# Altium project AMC_FMC_Carrier v4.PrjPcb (part 13 of 18)

## Sheet Clock_management.SchDoc: AMC FMC Carrier v4
size 420 x 297 mm; CompanyName: WUT; Organization: WUT ISE; Address1: Warsaw Univeristy of Technology; Address2: Nowowiejska 15/19 00-665 Warsaw; Address3: t.przywozki@gmail.com; Revision: 1; SheetNumber: 22; SheetTotal: 29; Project: AMC FMC Carrier v4; ModifiedBy: -; CheckedDate: -; Title2: Clock Management; DivGrp: ISE; Designer: T. Przywozki; ModifiedDate: -; ProjectName: ADC/DAC MEZZANINE
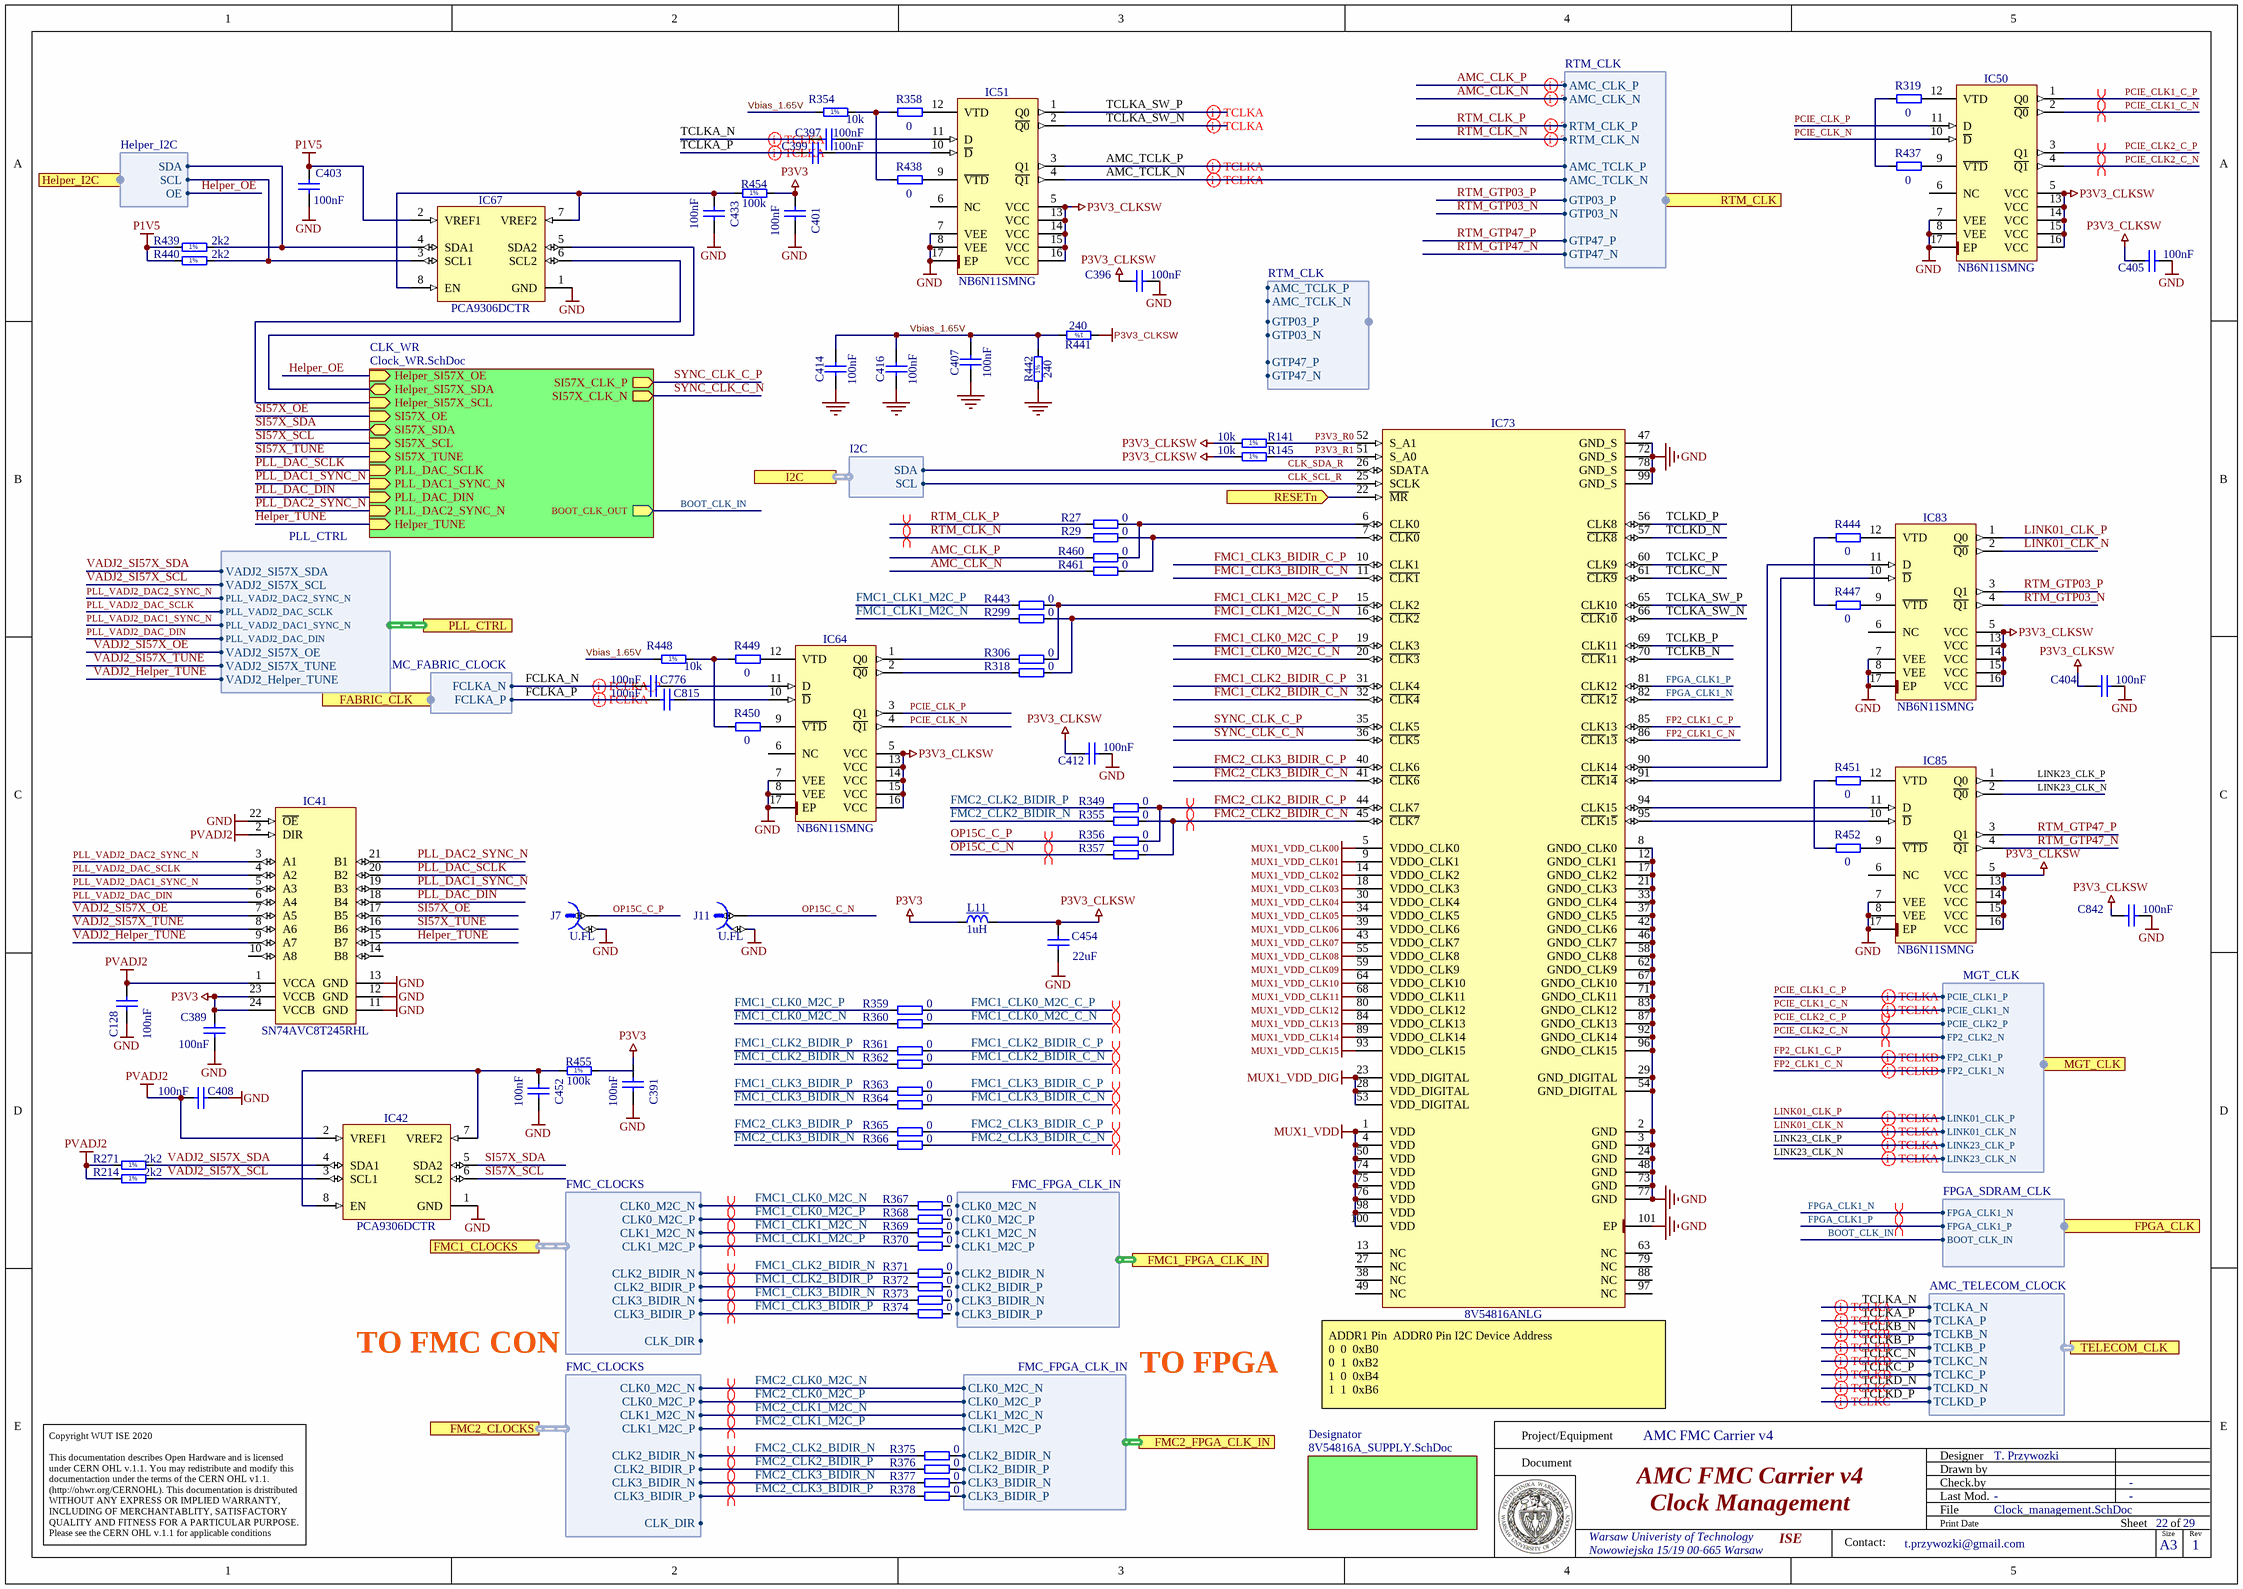
[diagram p23: Clock_management.SchDoc]

### Parts
(Parts that share a designator on the sheet are numbered #1, #2 ... from top to bottom, then left to right.)
C128  100nF  [CAPC0603X33N]
C389  100nF  [CAPC0603X33N]
C391  100nF  [CAPC0603X33N]
C396  100nF  [CAPC0603X33N]
C397  100nF  [CAPC0603X33N]
C399  100nF  [CAPC0603X33N]
C401  100nF  [CAPC0603X33N]
C403  100nF  [CAPC0603X33N]
C404  100nF  [CAPC0603X33N]
C405  100nF  [CAPC0603X33N]
C407  100nF  [CAPC0603X33N]
C408  100nF  [CAPC0603X33N]
C412  100nF  [CAPC0603X33N]
C414  100nF  [CAPC0603X33N]
C416#1  100nF  [CAPC0603X33N]
C433#1  100nF  [CAPC0603X33N]
C452#1  100nF  [CAPC0603X33N]
C454  22uF  [CAPC3216X180N]
C776  100nF  [CAPC0603X33N]
C815  100nF  [CAPC0603X33N]
C842  100nF  [CAPC0603X33N]
IC41  SN74AVC8T245RHL  [TEXAS_RHL (S-PVQFN-N24)]
IC42  PCA9306DCTR  [SOP65P400X130-8N]
IC50#1  NB6N11SMNG  [QFN50P300X300X100-17N-S185]
IC51#1  NB6N11SMNG  [QFN50P300X300X100-17N-S185]
IC64  NB6N11SMNG  [QFN50P300X300X100-17N-S185]
IC67  PCA9306DCTR  [SOP65P400X130-8N]
IC73  8V54816ANLG  [QFN40P1200X1200X90-101N-S690]
IC83  NB6N11SMNG  [QFN50P300X300X100-17N-S185]
IC85  NB6N11SMNG  [QFN50P300X300X100-17N-S185]
J7  U.FL  [HIROSE_U.FL-R-SMT-1(10)]
J11  U.FL  [HIROSE_U.FL-R-SMT-1(10)]
L11  1uH  [IND_PANASONIC_ELLVGG]
R27  0  [RESC1005X40N]
R29  0  [RESC1005X40N]
R141  10k  [RESC1005X40N]
R145  10k  [RESC1005X40N]
R214  2k2  [RESC1005X40N]
R271  2k2  [RESC1005X40N]
R299  0  [RESC1005X40N]
R306  0  [RESC1005X40N]
R318  0  [RESC1005X40N]
R319  0  [RESC1005X40N]
R349  0  [RESC1005X40N]
R354  10k  [RESC1005X40N]
R355  0  [RESC1005X40N]
R356  0  [RESC1005X40N]
R357  0  [RESC1005X40N]
R358  0  [RESC1005X40N]
R359  0  [RESC1005X40N]
R360  0  [RESC1005X40N]
R361  0  [RESC1005X40N]
R362  0  [RESC1005X40N]
R363  0  [RESC1005X40N]
R364  0  [RESC1005X40N]
R365  0  [RESC1005X40N]
R366  0  [RESC1005X40N]
R367  0  [RESC1005X40N]
R368  0  [RESC1005X40N]
R369  0  [RESC1005X40N]
R370  0  [RESC1005X40N]
R371  0  [RESC1005X40N]
R372  0  [RESC1005X40N]
R373  0  [RESC1005X40N]
R374  0  [RESC1005X40N]
R375  0  [RESC1005X40N]
R376  0  [RESC1005X40N]
R377  0  [RESC1005X40N]
R378  0  [RESC1005X40N]
R437  0  [RESC1005X40N]
R438  0  [RESC1005X40N]
R439  2k2  [RESC1005X40N]
R440  2k2  [RESC1005X40N]
R441  240  [RESC1005X40N]
R442  240  [RESC1005X40N]
R443  0  [RESC1005X40N]
R444  0  [RESC1005X40N]
R447  0  [RESC1005X40N]
R448  10k  [RESC1005X40N]
R449  0  [RESC1005X40N]
R450  0  [RESC1005X40N]
R451  0  [RESC1005X40N]
R452  0  [RESC1005X40N]
R454  100k  [RESC1005X40N]
R455  100k  [RESC1005X40N]
R460  0  [RESC1005X40N]
R461  0  [RESC1005X40N]

### Sub-sheets
CLK_WR = Clock_WR.SchDoc: SI57X_OE (in), SI57X_SDA (bidir), SI57X_SCL (in), SI57X_CLK_P (out), SI57X_CLK_N (out), SI57X_TUNE (in), PLL_DAC_SCLK (in), PLL_DAC1_SYNC_N (in), PLL_DAC_DIN (in), PLL_DAC2_SYNC_N (in), BOOT_CLK_OUT (out), Helper_SI57X_SDA (bidir), Helper_SI57X_SCL (in), Helper_SI57X_OE (in), Helper_TUNE (in)
Designator = 8V54816A_SUPPLY.SchDoc (file not in this document): no entries

### Ports
FABRIC_CLK (harness AMC_FABRIC_CLOCK), FMC1_CLOCKS (harness FMC_CLOCKS), FMC1_FPGA_CLK_IN (harness FMC_FPGA_CLK_IN), FMC2_CLOCKS (harness FMC_CLOCKS), FMC2_FPGA_CLK_IN (harness FMC_FPGA_CLK_IN), FPGA_CLK (harness FPGA_SDRAM_CLK), Helper_I2C (harness Helper_I2C), I2C (harness I2C), MGT_CLK (harness MGT_CLK), PLL_CTRL (harness PLL_CTRL), RESETn (in), RTM_CLK (harness RTM_CLK), TELECOM_CLK (harness AMC_TELECOM_CLOCK)

### Harnesses
AMC_FABRIC_CLOCK: FCLKA_N, FCLKA_P
AMC_TELECOM_CLOCK: TCLKA_N, TCLKA_P, TCLKB_N, TCLKB_P, TCLKC_N, TCLKC_P, TCLKD_N, TCLKD_P
MGT_CLK: PCIE_CLK1_P, PCIE_CLK1_N, FP2_CLK1_P, FP2_CLK1_N, PCIE_CLK2_P, FP2_CLK2_N, LINK01_CLK_P, LINK01_CLK_N, LINK23_CLK_P, LINK23_CLK_N
FPGA_SDRAM_CLK: FPGA_CLK1_N, FPGA_CLK1_P, BOOT_CLK_IN
PLL_CTRL: PLL_VADJ2_DAC2_SYNC_N, PLL_VADJ2_DAC_SCLK, PLL_VADJ2_DAC1_SYNC_N, PLL_VADJ2_DAC_DIN, VADJ2_SI57X_OE, VADJ2_SI57X_TUNE, VADJ2_SI57X_SDA, VADJ2_SI57X_SCL, VADJ2_Helper_TUNE
I2C: SCL, SDA
FMC_CLOCKS: CLK0_M2C_N, CLK0_M2C_P, CLK1_M2C_N, CLK1_M2C_P, CLK_DIR, CLK2_BIDIR_N, CLK2_BIDIR_P, CLK3_BIDIR_N, CLK3_BIDIR_P
FMC_FPGA_CLK_IN: CLK0_M2C_N, CLK0_M2C_P, CLK1_M2C_N, CLK1_M2C_P, CLK2_BIDIR_N, CLK2_BIDIR_P, CLK3_BIDIR_N, CLK3_BIDIR_P
Helper_I2C: SDA, SCL, OE
RTM_CLK: GTP03_P, GTP03_N, GTP47_P, GTP47_N, AMC_TCLK_P, AMC_TCLK_N
RTM_CLK: GTP03_P, GTP03_N, GTP47_P, GTP47_N, AMC_TCLK_P, AMC_TCLK_N, RTM_CLK_P, RTM_CLK_N, AMC_CLK_P, AMC_CLK_N

### Nets
GND: C128.1 C389.1 C391.1 C396.1 C401.1 C403.1 C404.1 C405.1 C407.2 C408.1 C412.1 C414.2 C416#1.2 C433#1.1 C452#1.1 C454.1 C842.1 IC41.11(GND) IC41.12(GND) IC41.13(GND) IC41.22(~{OE}) IC42.1(GND) IC50#1.7(VEE) IC50#1.8(VEE) IC50#1.17(EP) IC51#1.7(VEE) IC51#1.8(VEE) IC51#1.17(EP) IC64.7(VEE) IC64.8(VEE) IC64.17(EP) IC67.1(GND) IC73.2(GND) IC73.3(GND) IC73.8(GNDO_CLK0) IC73.12(GNDO_CLK1) IC73.17(GNDO_CLK2) IC73.21(GNDO_CLK3) IC73.24(GND) IC73.29(GND_DIGITAL) IC73.33(GNDO_CLK4) IC73.37(GNDO_CLK5) IC73.42(GNDO_CLK6) IC73.46(GNDO_CLK7) IC73.47(GND_S) IC73.48(GND) IC73.54(GND_DIGITAL) IC73.58(GNDO_CLK8) IC73.62(GNDO_CLK9) IC73.67(GNDO_CLK10) IC73.71(GNDO_CLK11) IC73.72(GND_S) IC73.73(GND) IC73.77(GND) IC73.78(GND_S) IC73.83(GNDO_CLK12) IC73.87(GNDO_CLK13) IC73.92(GNDO_CLK14) IC73.96(GNDO_CLK15) IC73.99(GND_S) IC73.101(EP) IC83.7(VEE) IC83.8(VEE) IC83.17(EP) IC85.7(VEE) IC85.8(VEE) IC85.17(EP) J7.2 J11.2 R442.1
MUX1_VDD: IC73.1(VDD) IC73.4(VDD) IC73.50(VDD) IC73.74(VDD) IC73.75(VDD) IC73.76(VDD) IC73.98(VDD) IC73.100(VDD)
MUX1_VDD_CLK00: IC73.5(VDDO_CLK0)
MUX1_VDD_CLK01: IC73.9(VDDO_CLK1)
MUX1_VDD_CLK02: IC73.14(VDDO_CLK2)
MUX1_VDD_CLK03: IC73.18(VDDO_CLK3)
MUX1_VDD_CLK04: IC73.30(VDDO_CLK4)
MUX1_VDD_CLK05: IC73.34(VDDO_CLK5)
MUX1_VDD_CLK06: IC73.39(VDDO_CLK6)
MUX1_VDD_CLK07: IC73.43(VDDO_CLK7)
MUX1_VDD_CLK08: IC73.55(VDDO_CLK8)
MUX1_VDD_CLK09: IC73.59(VDDO_CLK9)
MUX1_VDD_CLK10: IC73.64(VDDO_CLK10)
MUX1_VDD_CLK11: IC73.68(VDDO_CLK11)
MUX1_VDD_CLK12: IC73.80(VDDO_CLK12)
MUX1_VDD_CLK13: IC73.84(VDDO_CLK13)
MUX1_VDD_CLK14: IC73.89(VDDO_CLK14)
MUX1_VDD_CLK15: IC73.93(VDDO_CLK15)
MUX1_VDD_DIG: IC73.23(VDD_DIGITAL) IC73.28(VDD_DIGITAL) IC73.53(VDD_DIGITAL)
P1V5: C403.2 IC67.2(VREF1) R439.1 R440.1
P3V3: C389.2 C391.2 C401.2 IC41.23(VCCB) IC41.24(VCCB) L11.1 R454.2
P3V3_CLKSW: C396.2 C404.2 C405.2 C412.2 C454.2 C842.2 IC50#1.5(VCC) IC50#1.13(VCC) IC50#1.14(VCC) IC50#1.15(VCC) IC50#1.16(VCC) IC51#1.5(VCC) IC51#1.13(VCC) IC51#1.14(VCC) IC51#1.15(VCC) IC51#1.16(VCC) IC64.5(VCC) IC64.13(VCC) IC64.14(VCC) IC64.15(VCC) IC64.16(VCC) IC83.5(VCC) IC83.13(VCC) IC83.14(VCC) IC83.15(VCC) IC83.16(VCC) IC85.5(VCC) IC85.13(VCC) IC85.14(VCC) IC85.15(VCC) IC85.16(VCC) L11.2 R141.2 R145.2 R441.1
PVADJ2: C128.2 C408.2 IC41.1(VCCA) IC41.2(DIR) IC42.2(VREF1) R214.1 R271.1
AMC_CLK_N: R461.1 ; port RTM_CLK.AMC_CLK_N
AMC_CLK_P: R460.1 ; port RTM_CLK.AMC_CLK_P
AMC_TCLK_N: IC51#1.4(~{Q1}) ; port RTM_CLK.AMC_TCLK_N
AMC_TCLK_P: IC51#1.3(Q1) ; port RTM_CLK.AMC_TCLK_P
BOOT_CLK_IN: sheet CLK_WR/BOOT_CLK_OUT, port FPGA_CLK.BOOT_CLK_IN  [project net FPGA_CLK.BOOT_CLK_IN]
CLK_SCL_R: IC73.25(SCLK) ; port I2C.SCL  [project net CLK_I2C.SCL]
CLK_SDA_R: IC73.26(SDATA) ; port I2C.SDA  [project net CLK_I2C.SDA]
FCLKA_N: C776.1 ; port FABRIC_CLK.FCLKA_N
FCLKA_P: C815.1 ; port FABRIC_CLK.FCLKA_P
FMC1_CLK0_M2C_C_N: IC73.20(~{CLK3}) R360.2
FMC1_CLK0_M2C_C_P: IC73.19(CLK3) R359.2
FMC1_CLK0_M2C_N: R360.1 R367.1 ; port FMC1_CLOCKS.CLK0_M2C_N  [project net CLKS1.CLK0_M2C_N]
FMC1_CLK0_M2C_P: R359.1 R368.1 ; port FMC1_CLOCKS.CLK0_M2C_P  [project net CLKS1.CLK0_M2C_P]
FMC1_CLK1_M2C_C_N: IC73.16(~{CLK2}) R299.2 R318.2
FMC1_CLK1_M2C_C_P: IC73.15(CLK2) R306.2 R443.2
FMC1_CLK1_M2C_N: R299.1 R369.1 ; port FMC1_CLOCKS.CLK1_M2C_N  [project net CLKS1.CLK1_M2C_N]
FMC1_CLK1_M2C_P: R370.1 R443.1 ; port FMC1_CLOCKS.CLK1_M2C_P  [project net CLKS1.CLK1_M2C_P]
FMC1_CLK2_BIDIR_C_N: IC73.32(~{CLK4}) R362.2
FMC1_CLK2_BIDIR_C_P: IC73.31(CLK4) R361.2
FMC1_CLK2_BIDIR_N: R362.1 R371.1 ; port FMC1_CLOCKS.CLK2_BIDIR_N  [project net CLKS1.CLK2_BIDIR_N]
FMC1_CLK2_BIDIR_P: R361.1 R372.1 ; port FMC1_CLOCKS.CLK2_BIDIR_P  [project net CLKS1.CLK2_BIDIR_P]
FMC1_CLK3_BIDIR_C_N: IC73.11(~{CLK1}) R364.2
FMC1_CLK3_BIDIR_C_P: IC73.10(CLK1) R363.2
FMC1_CLK3_BIDIR_N: R364.1 R373.1 ; port FMC1_CLOCKS.CLK3_BIDIR_N  [project net CLKS1.CLK3_BIDIR_N]
FMC1_CLK3_BIDIR_P: R363.1 R374.1 ; port FMC1_CLOCKS.CLK3_BIDIR_P  [project net CLKS1.CLK3_BIDIR_P]
FMC2_CLK0_M2C_N: port FMC2_CLOCKS.CLK0_M2C_N, port FMC2_FPGA_CLK_IN.CLK0_M2C_N  [project net FMCC2.CLK0_M2C_N]
FMC2_CLK0_M2C_P: port FMC2_CLOCKS.CLK0_M2C_P, port FMC2_FPGA_CLK_IN.CLK0_M2C_P  [project net FMCC2.CLK0_M2C_P]
FMC2_CLK1_M2C_N: port FMC2_CLOCKS.CLK1_M2C_N, port FMC2_FPGA_CLK_IN.CLK1_M2C_N  [project net FMCC2.CLK1_M2C_N]
FMC2_CLK1_M2C_P: port FMC2_CLOCKS.CLK1_M2C_P, port FMC2_FPGA_CLK_IN.CLK1_M2C_P  [project net FMCC2.CLK1_M2C_P]
FMC2_CLK2_BIDIR_C_N: IC73.45(~{CLK7}) R355.2 R357.2
FMC2_CLK2_BIDIR_C_P: IC73.44(CLK7) R349.2 R356.2
FMC2_CLK2_BIDIR_N: R355.1 R375.1 ; port FMC2_CLOCKS.CLK2_BIDIR_N  [project net CLK2_BIDIR_N]
FMC2_CLK2_BIDIR_P: R349.1 R376.1 ; port FMC2_CLOCKS.CLK2_BIDIR_P  [project net CLK2_BIDIR_P]
FMC2_CLK3_BIDIR_C_N: IC73.41(~{CLK6}) R366.2
FMC2_CLK3_BIDIR_C_P: IC73.40(CLK6) R365.2
FMC2_CLK3_BIDIR_N: R366.1 R377.1 ; port FMC2_CLOCKS.CLK3_BIDIR_N  [project net CLK3_BIDIR_N]
FMC2_CLK3_BIDIR_P: R365.1 R378.1 ; port FMC2_CLOCKS.CLK3_BIDIR_P  [project net CLK3_BIDIR_P]
FMCC2.CLK2_BIDIR_N: R375.2 ; port FMC2_FPGA_CLK_IN.CLK2_BIDIR_N
FMCC2.CLK2_BIDIR_P: R376.2 ; port FMC2_FPGA_CLK_IN.CLK2_BIDIR_P
FMCC2.CLK3_BIDIR_N: R377.2 ; port FMC2_FPGA_CLK_IN.CLK3_BIDIR_N
FMCC2.CLK3_BIDIR_P: R378.2 ; port FMC2_FPGA_CLK_IN.CLK3_BIDIR_P
FP2_CLK1_C_N: IC73.86(~{CLK}1~{3}) ; port MGT_CLK.FP2_CLK1_N  [project net MGT.FP2_CLK1_N]
FP2_CLK1_C_P: IC73.85(CLK13) ; port MGT_CLK.FP2_CLK1_P  [project net MGT.FP2_CLK1_P]
FPGA_CLK1_N: IC73.82(~{CLK}1~{2}) ; port FPGA_CLK.FPGA_CLK1_N  [project net FPGA_CLK.FPGA_CLK1_N]
FPGA_CLK1_P: IC73.81(CLK12) ; port FPGA_CLK.FPGA_CLK1_P  [project net FPGA_CLK.FPGA_CLK1_P]
Helper_OE: sheet CLK_WR/Helper_SI57X_OE, port Helper_I2C.OE
Helper_SCL: IC67.3(SCL1) R440.2 ; port Helper_I2C.SCL
Helper_SDA: IC67.4(SDA1) R439.2 ; port Helper_I2C.SDA
Helper_SI57X_SCL: IC67.6(SCL2) ; sheet CLK_WR/Helper_SI57X_SCL
Helper_SI57X_SDA: IC67.5(SDA2) ; sheet CLK_WR/Helper_SI57X_SDA
Helper_TUNE: IC41.15(B7) ; sheet CLK_WR/Helper_TUNE
LINK01_CLK_N: IC83.2(~{Q0}) ; port MGT_CLK.LINK01_CLK_N  [project net MGT.LINK01_CLK_N]
LINK01_CLK_P: IC83.1(Q0) ; port MGT_CLK.LINK01_CLK_P  [project net MGT.LINK01_CLK_P]
LINK23_CLK_N: IC85.2(~{Q0}) ; port MGT_CLK.LINK23_CLK_N  [project net MGT.LINK23_CLK_N]
LINK23_CLK_P: IC85.1(Q0) ; port MGT_CLK.LINK23_CLK_P  [project net MGT.LINK23_CLK_P]
OP15C_C_N: J11.1 R357.1
OP15C_C_P: J7.1 R356.1
P3V3_R0: IC73.52(S_A1) R141.1
P3V3_R1: IC73.51(S_A0) R145.1
PCIE_CLK1_C_N: IC50#1.2(~{Q0}) ; port MGT_CLK.PCIE_CLK1_N  [project net MGT.PCIE_CLK1_N]
PCIE_CLK1_C_P: IC50#1.1(Q0) ; port MGT_CLK.PCIE_CLK1_P  [project net MGT.PCIE_CLK1_P]
PCIE_CLK2_C_N: IC50#1.4(~{Q1}) ; port MGT_CLK.FP2_CLK2_N  [project net MGT.FP2_CLK2_N]
PCIE_CLK2_C_P: IC50#1.3(Q1) ; port MGT_CLK.PCIE_CLK2_P  [project net MGT.PCIE_CLK2_P]
PCIE_CLK_N: IC50#1.10(~{D}) IC64.4(~{Q1})
PCIE_CLK_P: IC50#1.11(D) IC64.3(Q1)
PLL_DAC1_SYNC_N: IC41.19(B3) ; sheet CLK_WR/PLL_DAC1_SYNC_N
PLL_DAC2_SYNC_N: IC41.21(B1) ; sheet CLK_WR/PLL_DAC2_SYNC_N
PLL_DAC_DIN: IC41.18(B4) ; sheet CLK_WR/PLL_DAC_DIN
PLL_DAC_SCLK: IC41.20(B2) ; sheet CLK_WR/PLL_DAC_SCLK
PLL_VADJ2_DAC1_SYNC_N: IC41.5(A3) ; port PLL_CTRL.PLL_VADJ2_DAC1_SYNC_N  [project net PLL_CTRL.PLL_VADJ2_DAC1_SYNC_N]
PLL_VADJ2_DAC2_SYNC_N: IC41.3(A1) ; port PLL_CTRL.PLL_VADJ2_DAC2_SYNC_N  [project net PLL_CTRL.PLL_VADJ2_DAC2_SYNC_N]
PLL_VADJ2_DAC_DIN: IC41.6(A4) ; port PLL_CTRL.PLL_VADJ2_DAC_DIN  [project net PLL_CTRL.PLL_VADJ2_DAC_DIN]
PLL_VADJ2_DAC_SCLK: IC41.4(A2) ; port PLL_CTRL.PLL_VADJ2_DAC_SCLK  [project net PLL_CTRL.PLL_VADJ2_DAC_SCLK]
RESETn: IC73.22(~{MR}) ; port RESETn
RTM_CLK_N: R29.1 ; port RTM_CLK.RTM_CLK_N
RTM_CLK_P: R27.1 ; port RTM_CLK.RTM_CLK_P
RTM_GTP03_N: IC83.4(~{Q1}) ; port RTM_CLK.GTP03_N
RTM_GTP03_P: IC83.3(Q1) ; port RTM_CLK.GTP03_P
RTM_GTP47_N: IC85.4(~{Q1}) ; port RTM_CLK.GTP47_N
RTM_GTP47_P: IC85.3(Q1) ; port RTM_CLK.GTP47_P
SI57X_OE: IC41.17(B5) ; sheet CLK_WR/SI57X_OE
SI57X_SCL: IC42.6(SCL2) ; sheet CLK_WR/SI57X_SCL
SI57X_SDA: IC42.5(SDA2) ; sheet CLK_WR/SI57X_SDA
SI57X_TUNE: IC41.16(B6) ; sheet CLK_WR/SI57X_TUNE
SYNC_CLK_C_N: IC73.36(~{CLK5}) ; sheet CLK_WR/SI57X_CLK_N
SYNC_CLK_C_P: IC73.35(CLK5) ; sheet CLK_WR/SI57X_CLK_P
TCLKA_N: C397.2 ; port TELECOM_CLK.TCLKA_N
TCLKA_P: C399.2 ; port TELECOM_CLK.TCLKA_P
TCLKA_SW_N: IC51#1.2(~{Q0}) IC73.66(~{CLK}1~{0})
TCLKA_SW_P: IC51#1.1(Q0) IC73.65(CLK10)
TCLKB_N: IC73.70(~{CLK}11) ; port TELECOM_CLK.TCLKB_N
TCLKB_P: IC73.69(CLK11) ; port TELECOM_CLK.TCLKB_P
TCLKC_N: IC73.61(~{CLK9}) ; port TELECOM_CLK.TCLKC_N
TCLKC_P: IC73.60(CLK9) ; port TELECOM_CLK.TCLKC_P
TCLKD_N: IC73.57(~{CLK8}) ; port TELECOM_CLK.TCLKD_N
TCLKD_P: IC73.56(CLK8) ; port TELECOM_CLK.TCLKD_P
VADJ2_Helper_TUNE: IC41.9(A7) ; port PLL_CTRL.VADJ2_Helper_TUNE  [project net PLL_CTRL.VADJ2_Helper_TUNE]
VADJ2_SI57X_OE: IC41.7(A5) ; port PLL_CTRL.VADJ2_SI57X_OE  [project net PLL_CTRL.VADJ2_SI57X_OE]
VADJ2_SI57X_SCL: IC42.3(SCL1) R214.2 ; port PLL_CTRL.VADJ2_SI57X_SCL  [project net PLL_CTRL.VADJ2_SI57X_SCL]
VADJ2_SI57X_SDA: IC42.4(SDA1) R271.2 ; port PLL_CTRL.VADJ2_SI57X_SDA  [project net PLL_CTRL.VADJ2_SI57X_SDA]
VADJ2_SI57X_TUNE: IC41.8(A6) ; port PLL_CTRL.VADJ2_SI57X_TUNE  [project net PLL_CTRL.VADJ2_SI57X_TUNE]
Vbias_1.65V: C407.1 C414.1 C416#1.1 R354.1 R441.2 R442.2 R448.1
NetC397_1: C397.1 IC51#1.11(D)
NetC399_1: C399.1 IC51#1.10(~{D})
NetC433#1_2: C433#1.2 IC67.7(VREF2) IC67.8(EN) R454.1
NetC452#1_2: C452#1.2 IC42.7(VREF2) IC42.8(EN) R455.1
NetC776_2: C776.2 IC64.11(D)
NetC815_2: C815.2 IC64.10(~{D})
NetIC50#1_9: IC50#1.9(~{VTD}) R437.2
NetIC50#1_12: IC50#1.12(VTD) R319.2
NetIC51#1_9: IC51#1.9(~{VTD}) R438.2
NetIC51#1_12: IC51#1.12(VTD) R358.2
NetIC64_1: IC64.1(Q0) R306.1
NetIC64_2: IC64.2(~{Q0}) R318.1
NetIC64_9: IC64.9(~{VTD}) R450.2
NetIC64_12: IC64.12(VTD) R449.2
NetIC73_6: IC73.6(CLK0) R27.2 R460.2
NetIC73_7: IC73.7(~{CLK0}) R29.2 R461.2
NetIC73_90: IC73.90(CLK14) IC83.11(D)
NetIC73_91: IC73.91(~{CLK}1~{4}) IC83.10(~{D})
NetIC73_94: IC73.94(CLK15) IC85.11(D)
NetIC73_95: IC73.95(~{CLK}1~{5}) IC85.10(~{D})
NetIC83_9: IC83.9(~{VTD}) R447.2
NetIC83_12: IC83.12(VTD) R444.2
NetIC85_9: IC85.9(~{VTD}) R452.2
NetIC85_12: IC85.12(VTD) R451.2
NetR319_1: R319.1 R437.1
NetR354_2: R354.2 R358.1 R438.1
NetR444_1: R444.1 R447.1
NetR448_2: R448.2 R449.1 R450.1
NetR451_1: R451.1 R452.1

Not connected (* = marked no-connect by the designer): IC41 10(A8) 14(B8); IC50#1 6(NC); IC51#1 6(NC); IC64 6(NC); IC73 13(NC) 27(NC) 38(NC) 49(NC) 63(NC) 79(NC) 88(NC) 97(NC); IC83 6(NC); IC85 6(NC); R367 2; R368 2; R369 2; R370 2; R371 2; R372 2; R373 2; R374 2; R455 2

### Layout directives
differential pair: AMC_CLK_N, AMC_CLK_P, AMC_TCLK_N, AMC_TCLK_P, CLK2_BIDIR_N, CLK2_BIDIR_P, CLK3_BIDIR_N, CLK3_BIDIR_P, CLKS1.CLK0_M2C_N, CLKS1.CLK0_M2C_P, CLKS1.CLK1_M2C_N, CLKS1.CLK1_M2C_P, CLKS1.CLK2_BIDIR_N, CLKS1.CLK2_BIDIR_P, CLKS1.CLK3_BIDIR_N, CLKS1.CLK3_BIDIR_P, FCLKA_N, FCLKA_P, FMC1_CLK0_M2C_C_N, FMC1_CLK0_M2C_C_P, FMC1_CLK2_BIDIR_C_N, FMC1_CLK2_BIDIR_C_P, FMC1_CLK3_BIDIR_C_N, FMC1_CLK3_BIDIR_C_P, FMC2_CLK2_BIDIR_C_N, FMC2_CLK2_BIDIR_C_P, FMC2_CLK3_BIDIR_C_N, FMC2_CLK3_BIDIR_C_P, FMCC2.CLK0_M2C_N, FMCC2.CLK0_M2C_P, FMCC2.CLK1_M2C_N, FMCC2.CLK1_M2C_P, FPGA_CLK.FPGA_CLK1_N, FPGA_CLK.FPGA_CLK1_P, MGT.FP2_CLK1_N, MGT.FP2_CLK1_P, MGT.FP2_CLK2_N, MGT.LINK01_CLK_N, MGT.LINK01_CLK_P, MGT.LINK23_CLK_N, MGT.LINK23_CLK_P, MGT.PCIE_CLK1_N, MGT.PCIE_CLK1_P, MGT.PCIE_CLK2_P, OP15C_C_N, OP15C_C_P, RTM_CLK_N, RTM_CLK_P, TCLKA_N, TCLKA_P, TCLKA_SW_N, TCLKA_SW_P, TCLKB_N, TCLKB_P, TCLKC_N, TCLKC_P, TCLKD_N, TCLKD_P

### Notes on the sheet
- TO FMC CON
- TO FPGA
- (near IC73) ADDR1 Pin 	ADDR0 Pin	I2C Device Address
  0		0		0xB0
  0		1		0xB2
  1		0		0xB4
  1		1		0xB6
- Project/Equipment
- Document
- Designer
- Drawn by
- Check.by
- Copyright WUT ISE 2020
  This documentation describes Open Hardware and is licensed under CERN OHL v.1.1. You may redistribute and modify this documentaction under the terms of the CERN OHL v1.1.
  (http://ohwr.org/CERNOHL). This documentation is dristributed WITHOUT ANY EXPRESS OR IMPLIED WARRANTY, INCLUDING OF MERCHANTABLITY, SATISFACTORY QUALITY AND FITNESS FOR A PARTICULAR PURPOSE. Please see the CERN OHL v.1.1 for applicable conditions
- File
- Last Mod.
- Print Date
- Sheet
- Size
- A3
- of
- Rev
- Contact:
- (in symbol R0402_2K2_1%_0.0625W_100PPM) 1%
- (in symbol R0402_10K_1%_0.0625W_100PPM) 1%
- (in symbol R0402_100K_1%_0.0625W_100PPM) 1%
- (in symbol R0402_240R_1%_0.0625W_100PPM) 1%

### Library data of the parts
C128 C389 C391 C396 C397 C399 C401 C403-C405 C408 C412 C433#1 C452#1 C776 C815 C842 = CC0201_100NF_6.3V_10%_X5R: Non-polarised capacitor; Part Description: SMD Multilayer Chip Ceramic Capacitor; Manufacturer: GENERIC; Manufacturer1 Part Number: 02016D104KAT2A; Voltage: 6.3V; TC: X5R; Tolerance: ±10%; Table: Capacitors SMD; Part Number: CC0201_100NF_6.3V_10%_X5R; Component Kind: Standard; Component Type: Standard; Pin Count: 2; Value: 100nF; Status: Not Recommended; Manufacturer Part Number: CC0201_100NF_6.3V_10%_X5R; Case: 0201; Mounted: Yes; Socket: No; SMD: Yes; Manufacturer1 Example: AVX; Manufacturer1 ComponentHeight: 0.33mm; HelpURL: \\cern.ch\dfs\Applications\Altium\Datasheets\CC0201_X5R_AVX.pdf; Author: CERN DEM JLC; CreateDate: 2007-12-03; LatestRevisionDate: 2007-12-03
C407 C414 C416#1 = CC0201_100NF_6.3V_10%_X5R: Non-polarised capacitor; Manufacturer: GENERIC; Part Description: SMD Multilayer Chip Ceramic Capacitor; Manufacturer1 Part Number: 02016D104KAT2A; Tolerance: ±10%; Voltage: 6.3V; TC: X5R; Manufacturer Part Number: CC0201_100NF_6.3V_10%_X5R; Part Number: CC0201_100NF_6.3V_10%_X5R; Value: 100nF; Component Kind: Standard; Component Type: Standard; Pin Count: 2; Status: Not Recommended; Case: 0201; Mounted: Yes; Socket: No; SMD: Yes; Sense: No; Manufacturer1 Example: AVX; Manufacturer1 ComponentHeight: 0.33mm; HelpURL: \\cern.ch\dfs\Applications\Altium\Datasheets\CC0201_X5R_AVX.pdf; Author: CERN DEM JLC; CreateDate: 03.12.2007; LatestRevisionDate: 03.12.2007
C454 = CC1206_22UF_10V_10%_X7R: Non-polarised capacitor; Part Description: SMD Multilayer Chip Ceramic Capacitor; Manufacturer: GENERIC; Manufacturer1 Part Number: GRM31CR71A226KE15L; Voltage: 10V; TC: X7R; Tolerance: ±10%; Table: Capacitors SMD; Part Number: CC1206_22UF_10V_10%_X7R; Component Kind: Standard; Component Type: Standard; Pin Count: 2; Value: 22uF; Status: Preferred; Manufacturer Part Number: CC1206_22UF_10V_10%_X7R; Case: 1206; Mounted: Yes; Socket: No; SMD: Yes; Manufacturer1 Example: MURATA; Manufacturer1 ComponentHeight: 1.8mm; HelpURL: \\cern.ch\dfs\Applications\Altium\Datasheets\CC1206_X7R_MURATA_GRM-HI-CAP.pdf; Author: CERN DEM JLC; CreateDate: 2010-06-08; LatestRevisionDate: 2010-06-08
IC41 = SN74AVC8T245RHL: 8-Bit Dual-Supply Bus Transceiver With Configurable Voltage Translation and 3-State Outputs; Manufacturer: TEXAS INSTRUMENTS; PressFit: No; Bonding: No; Part Number: SN74AVC8T245RHL; Component Kind: Standard; Component Type: Standard; Device: SN74AVC8T245RHL; PackageDescription: TEXAS Case Style RHL (S-PVQFN-N24), QFN, 0.50mm Pitch, Rectangular; 24 Pin, 5.50mm L X 3.50mm W X 1mm H body (w/thermal tab 4.05 X 2.05mm); Part Description: 8-Bit Dual-Supply Bus Transceiver With Configurable Voltage Translation and 3-State Outputs; Manufacturer Part Number: SN74AVC8T245RHL; Pin Count: 25; Case: QFN24; Mounted: Yes; Socket: No; SMD: Yes; Sense: No; ComponentHeight: 1.0mm; Author: CERN DEM MR; HelpURL: \\cern.ch\dfs\Applications\Altium\Datasheets\SN74AVC8T245RHL.pdf; CreateDate: 09.11.2016; LatestRevisionDate: 09.11.2016
IC42 IC67 = PCA9306DCTR: Dual Bidirectional I2C Bus And SMBus Voltage-Level Translator; Manufacturer: TEXAS INSTRUMENTS; PressFit: No; Bonding: No; Part Number: PCA9306DCTR; Component Kind: Standard; Component Type: Standard; Device: PCA9306DCTR; PackageDescription: SOP, 0.65mm, Pitch; 8 Pin, 2.80mm W X 2.95mm L X 1.30mm H Body, PC Medium Density; Part Description: Dual Bidirectional I2C Bus And SMBus Voltage-Level Translator; Manufacturer Part Number: PCA9306DCTR; Pin Count: 8; Case: SSOP8; Mounted: Yes; Socket: No; SMD: Yes; Sense: No; ComponentHeight: 1.3mm; Author: CERN DEM JLC; HelpURL: \\cern.ch\dfs\Applications\Altium\Datasheets\PCA9306DCTR.pdf; CreateDate: 25.02.2013; LatestRevisionDate: 11.02.2016
IC50#1 IC51#1 IC64 IC83 IC85 = NB6N11SMNG: 3.3V 1:2 AnyLevel Input to LVDS Fanout Buffer / Translator; Manufacturer: ON SEMICONDUCTOR; PressFit: No; Bonding: No; Part Number: NB6N11SMNG; Component Kind: Standard; Component Type: Standard; Device: NB6N11SMNG; PackageDescription: QFN, 0.50mm Pitch, Square; 16 Pin, 3.00mm L X 3.00mm W X 1.00mm H body (w/Thermal Tab 1.85 X 1.85mm), IPC Medium Density; Part Description: 3.3V 1:2 AnyLevel Input to LVDS Fanout Buffer / Translator; Manufacturer Part Number: NB6N11SMNG; Pin Count: 17; Case: QFN16; Mounted: Yes; Socket: No; SMD: Yes; Sense: No; ComponentHeight: 1mm; Author: CERN DEM JLC; HelpURL: \\cern.ch\dfs\Applications\Altium\Datasheets\NB6N11SMNG.pdf; CreateDate: 14.05.2013; LatestRevisionDate: 14.05.2013
IC73 = 8V54816ANLG: 16-Port, Bi-directional M-LVDS Clock Cross-Point Switch; Manufacturer: INTEGRATED DEVICE TECHNOLOGY (IDT); PressFit: No; Bonding: No; Part Number: 8V54816ANLG; Component Kind: Standard; Component Type: Standard; Device: 8V54816ANLG; PackageDescription: QFN, 0.40mm Pitch, Square; 100 Pin, 12.0mm L X 12.0mm W X 0.90mm H body (w/Thermal Tab 6.90 X 6.90mm), IPC Medium Density; Status: Not Recommended; Part Description: 16-Port, Bi-directional M-LVDS Clock Cross-Point Switch; Manufacturer Part Number: 8V54816ANLG; Pin Count: 101; Case: QFN100; Mounted: Yes; Socket: No; SMD: Yes; Sense: No; ComponentHeight: 0.9mm; Author: CERN DEM MR; HelpURL: \\cern.ch\dfs\Applications\Altium\Datasheets\8V54816ANLG.pdf; CreateDate: 02.06.2016; LatestRevisionDate: 30.03.2017
J7 J11 = HIROSE_U.FL-R-SMT-1(10): Part Description: Up to 6GHz Ultra Small Surface Mount Male Coaxial Connectors U.FL Series; Manufacturer: HIROSE (HRS); PressFit: No; Part Number: HIROSE_U.FL-R-SMT-1(10); Component Kind: Standard; Component Type: Standard; Pin Count: 2; Family: U.FL; Mounted: Yes; Socket: No; SMD: Yes; Sense: No; Status: None; Manufacturer Part Number: U.FL-R-SMT-1(10); ComponentHeight: 1.25mm; HelpURL: \\cern.ch\dfs\Applications\Altium\Datasheets\HIROSE_U.FL-R-SMT-1(10).pdf; Author: CERN DEM JLC; CreateDate: 24.03.2010; LatestRevisionDate: 24.03.2010
L11 = IND_1UH_30%_PANASONIC_ELLVGG1R0N: Inductor With Core; Part Description: Wire Wound SMD Power Inductor, G Series, Type ELLVGG; Power: 1.8A; Resistance: 0.052R; Tolerance: ±30%; Part Number: IND_1UH_30%_PANASONIC_ELLVGG1R0N; Component Kind: Standard; Component Type: Standard; Pin Count: 2; Value: 1uH; Status: None; Manufacturer: PANASONIC; Manufacturer Part Number: ELLVGG1R0N; Mounted: Yes; Socket: No; SMD: Yes; Sense: No; ComponentHeight: 1.5mm; HelpURL: \\cern.ch\dfs\Applications\Altium\Datasheets\IND_PANASONIC_ELLVGG.pdf; Author: CERN DEM JLC; CreateDate: 09.11.2016; LatestRevisionDate: 09.11.2016
R27 R29 R299 R306 R318 R319 R349 R355-R378 R437 R438 R443 R444 R447 R449-R452 R460 R461 = R0402_0R_JUMPER: Resistor; Part Description: 1A (0.05R Max DC Resistance) Zero Ohm Jumper; Manufacturer: GENERIC; Manufacturer1 Part Number: 232270591001L; PressFit: No; Part Number: R0402_0R_JUMPER; Component Kind: Standard; Component Type: Standard; Pin Count: 2; Value: 0; Status: Not Recommended; Manufacturer Part Number: R0402_0R_JUMPER; Case: 0402; Mounted: Yes; Sense: No; Socket: No; SMD: Yes; Manufacturer1 Example: YAGEO PHYCOMP; Manufacturer1 ComponentHeight: 0.4mm; HelpURL: \\cern.ch\dfs\Applications\Altium\Datasheets\R0402_Phycomp_RC0402.pdf; Author: CERN DEM JLC; CreateDate: 03.12.2007; LatestRevisionDate: 17.10.2012
R141 R145 = R0402_10K_1%_0.0625W_100PPM: Resistor - 1%; Part Description: General Purpose Thick Film Chip Resistor; Manufacturer: GENERIC; Manufacturer1 Part Number: 232270671003L; TC: ±100ppm/°C; Table: Resistors SMD; Part Number: R0402_10K_1%_0.0625W_100PPM; Component Kind: Standard; Component Type: Standard; Pin Count: 2; Value: 10k; Status: Not recommended; Power: 0.0625W; Tolerance: ±1%; Manufacturer Part Number: R0402_10K_1%_0.0625W_100PPM; Case: 0402; Mounted: Yes; Socket: No; SMD: Yes; Manufacturer1 Example: YAGEO PHYCOMP; Manufacturer1 ComponentHeight: 0.4mm; HelpURL: \\cern.ch\dfs\Applications\Altium\Datasheets\R0402_Phycomp_RC0402.pdf; Author: CERN DEM JLC; CreateDate: 2007-12-03; LatestRevisionDate: 2012-10-17
R214 R271 R439 R440 = R0402_2K2_1%_0.0625W_100PPM: Resistor - 1%; Part Description: General Purpose Thick Film Chip Resistor; Manufacturer: GENERIC; Manufacturer1 Part Number: 232270672202L; TC: ±100ppm/°C; Table: Resistors SMD; Part Number: R0402_2K2_1%_0.0625W_100PPM; Component Kind: Standard; Component Type: Standard; Pin Count: 2; Value: 2k2; Status: Not recommended; Power: 0.0625W; Tolerance: ±1%; Manufacturer Part Number: R0402_2K2_1%_0.0625W_100PPM; Case: 0402; Mounted: Yes; Socket: No; SMD: Yes; Manufacturer1 Example: YAGEO PHYCOMP; Manufacturer1 ComponentHeight: 0.4mm; HelpURL: \\cern.ch\dfs\Applications\Altium\Datasheets\R0402_Phycomp_RC0402.pdf; Author: CERN DEM JLC; CreateDate: 2007-12-03; LatestRevisionDate: 2012-10-17
R354 R448 = R0402_10K_1%_0.0625W_100PPM: Resistor - 1%; Manufacturer: GENERIC; Part Description: General Purpose Thick Film Chip Resistor; Manufacturer1 Part Number: 232270671003L; TC: ±100ppm/°C; PressFit: No; Manufacturer Part Number: R0402_10K_1%_0.0625W_100PPM; Part Number: R0402_10K_1%_0.0625W_100PPM; Tolerance: ±1%; Value: 10k; Component Kind: Standard; Component Type: Standard; Pin Count: 2; Status: Not Recommended; Power: 0.0625W; Case: 0402; Mounted: Yes; Sense: No; Socket: No; SMD: Yes; Manufacturer1 Example: YAGEO PHYCOMP; Manufacturer1 ComponentHeight: 0.4mm; HelpURL: \\cern.ch\dfs\Applications\Altium\Datasheets\R0402_Phycomp_RC0402.pdf; Author: CERN DEM JLC; CreateDate: 03.12.2007; LatestRevisionDate: 17.10.2012
R441 R442 = R0402_240R_1%_0.0625W_100PPM: Resistor - 1%; Manufacturer: GENERIC; Part Description: General Purpose Thick Film Chip Resistor; Manufacturer1 Part Number: 232270672401L; TC: ±100ppm/°C; PressFit: No; Manufacturer Part Number: R0402_240R_1%_0.0625W_100PPM; Part Number: R0402_240R_1%_0.0625W_100PPM; Tolerance: ±1%; Value: 240; Component Kind: Standard; Component Type: Standard; Pin Count: 2; Status: Not Recommended; Power: 0.0625W; Case: 0402; Mounted: Yes; Sense: No; Socket: No; SMD: Yes; Manufacturer1 Example: YAGEO PHYCOMP; Manufacturer1 ComponentHeight: 0.4mm; HelpURL: \\cern.ch\dfs\Applications\Altium\Datasheets\R0402_Phycomp_RC0402.pdf; Author: CERN DEM JLC; CreateDate: 03.12.2007; LatestRevisionDate: 17.10.2012
R454 R455 = R0402_100K_1%_0.0625W_100PPM: Resistor - 1%; Part Description: General Purpose Thick Film Chip Resistor; Manufacturer: GENERIC; Manufacturer1 Part Number: 232270671004L; TC: ±100ppm/°C; Table: Resistors SMD; Part Number: R0402_100K_1%_0.0625W_100PPM; Component Kind: Standard; Component Type: Standard; Pin Count: 2; Value: 100k; Status: Not recommended; Power: 0.0625W; Tolerance: ±1%; Manufacturer Part Number: R0402_100K_1%_0.0625W_100PPM; Case: 0402; Mounted: Yes; Socket: No; SMD: Yes; Manufacturer1 Example: YAGEO PHYCOMP; Manufacturer1 ComponentHeight: 0.4mm; HelpURL: \\cern.ch\dfs\Applications\Altium\Datasheets\R0402_Phycomp_RC0402.pdf; Author: CERN DEM JLC; CreateDate: 2007-12-03; LatestRevisionDate: 2012-10-17